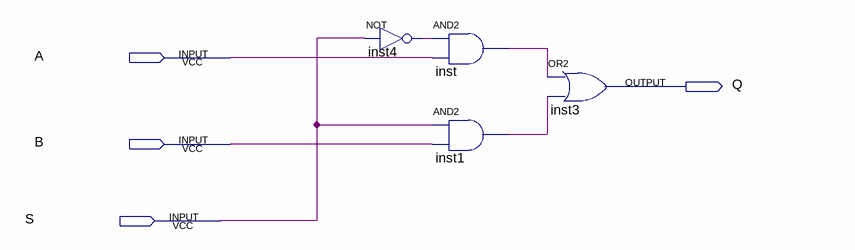
[diagram p0: schematic sheet]
// Quartus schematic mux2.bdf as structural Verilog: 4 symbols, 4 pins
module mux2 (
  input  A,
  input  B,
  input  S,
  output Q
);

  wire inst1_out, inst4_out, inst_out;

  not inst4 (inst4_out, S);
  and inst (inst_out, inst4_out, A);
  and inst1 (inst1_out, S, B);
  or inst3 (Q, inst_out, inst1_out);
endmodule
